# EasyEDA Pro project OT 1 ProPrj_PCB_PCB_Drum_2026-03-27_2026-04-04.epro

# Board PCB_PCB_Drum_2026-03-27
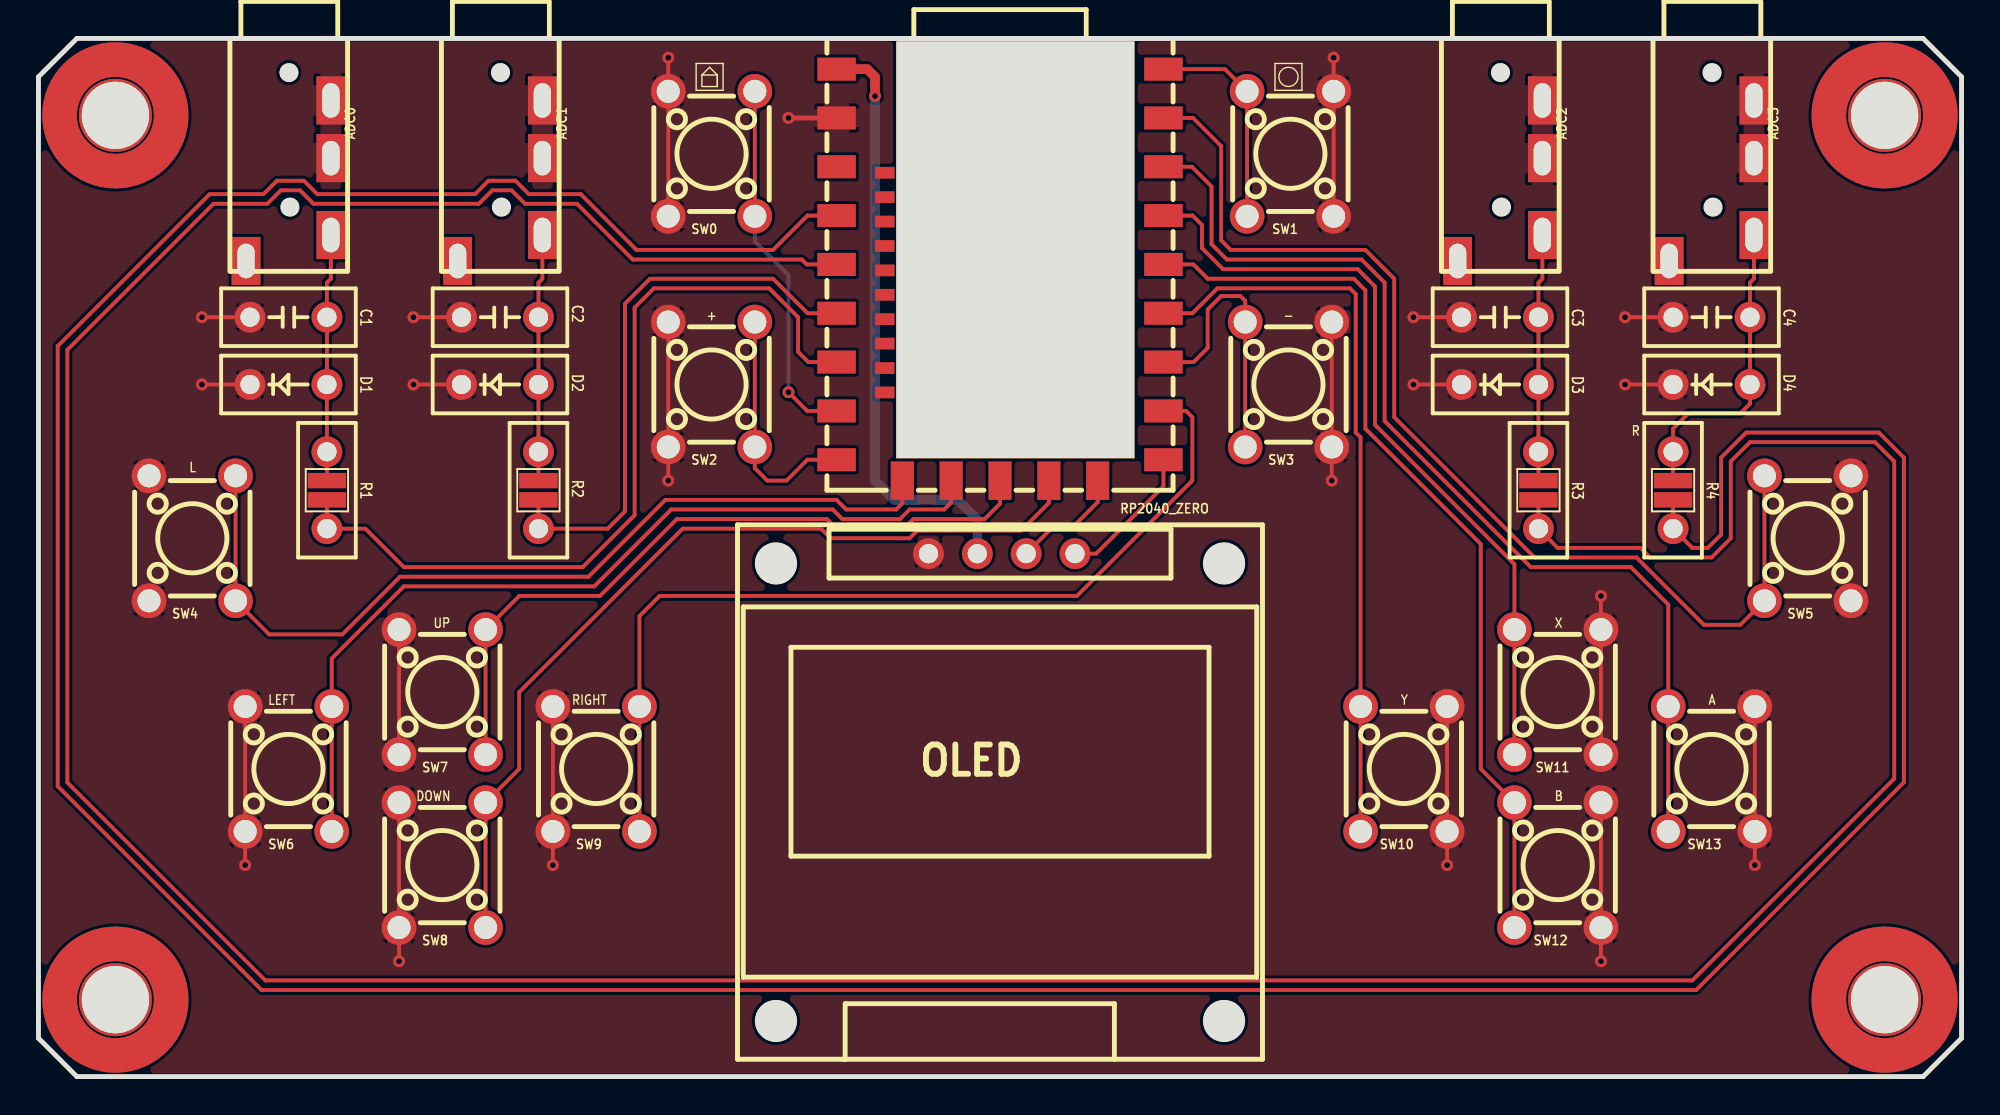
[diagram p0: board, top side]
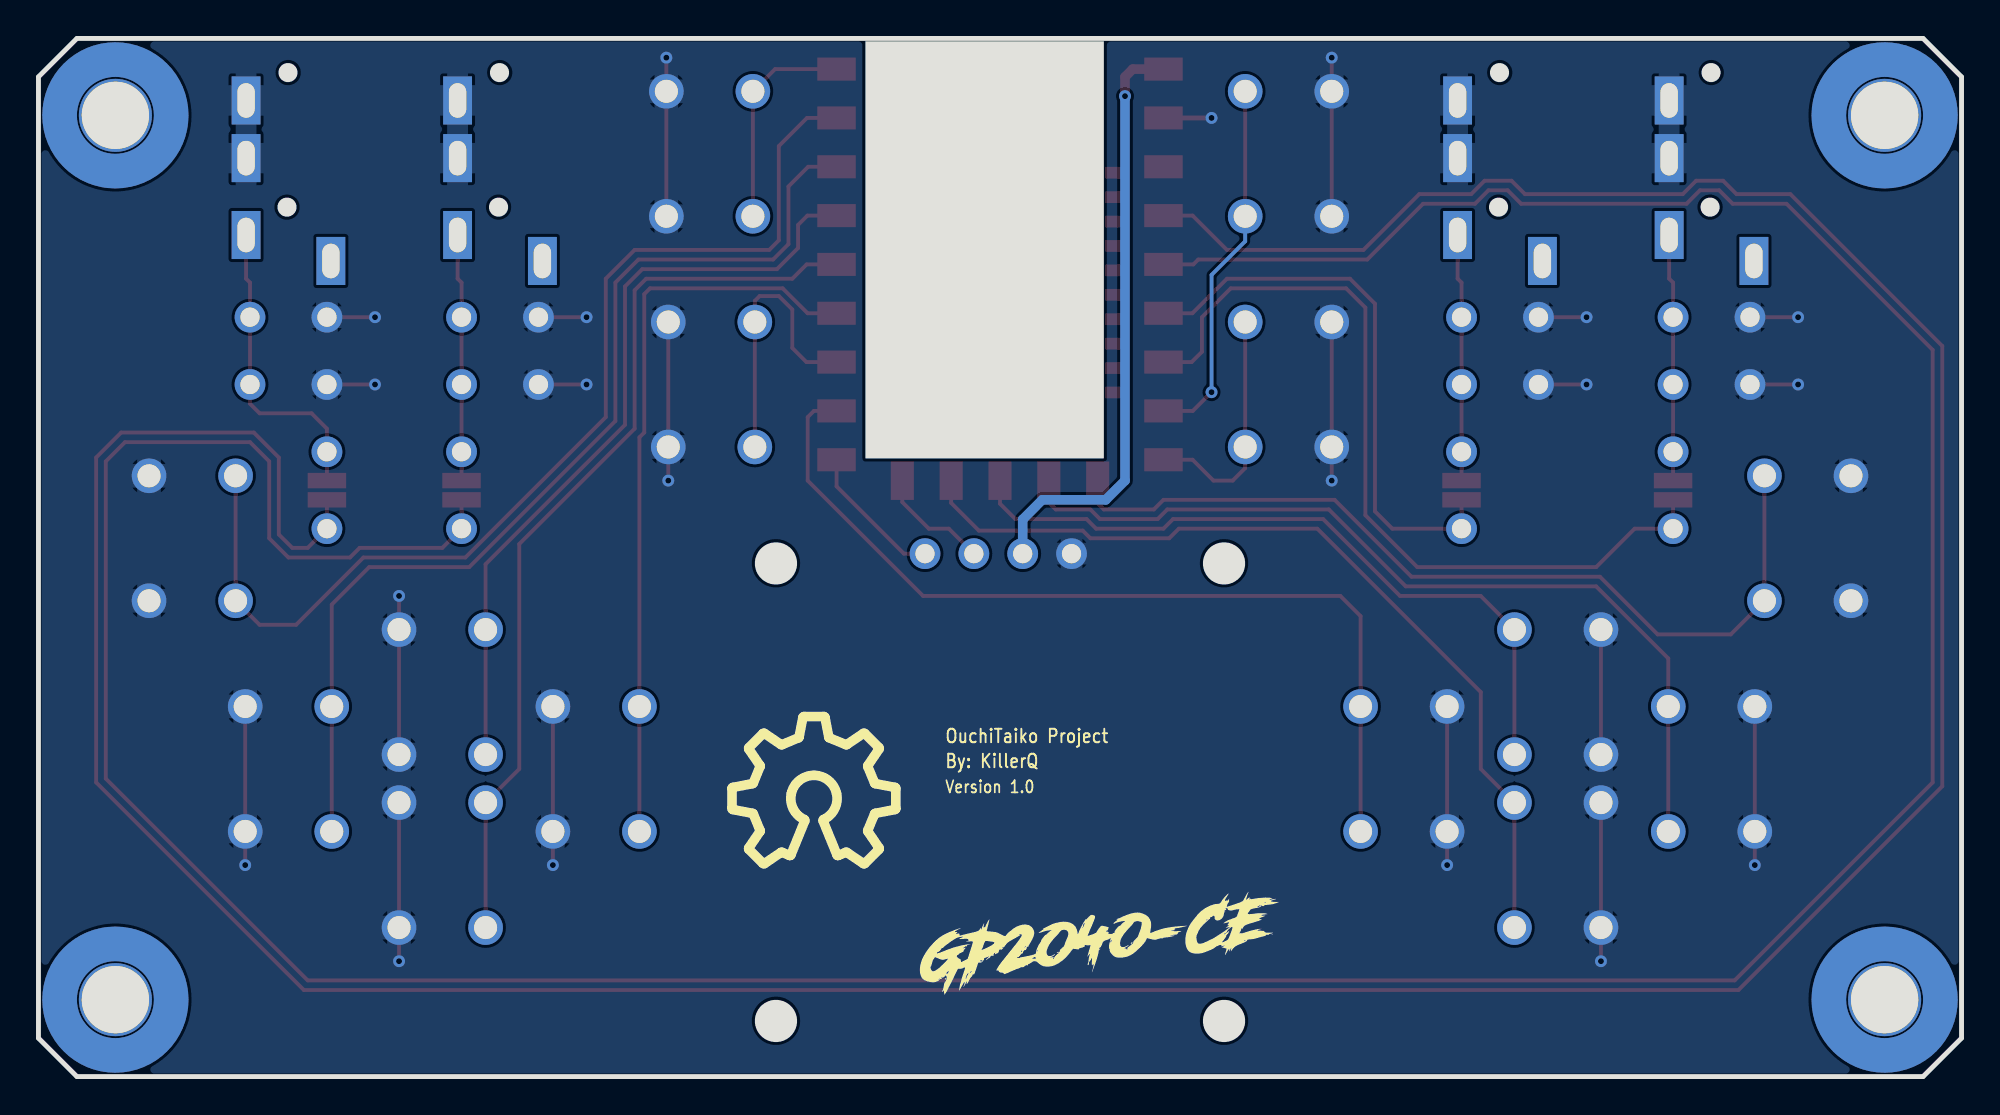
[diagram p1: board, bottom side, seen from below]

Outline 100 x 54 mm; copper layers: Top Layer, Bottom Layer. Coordinates in mm from the lower left corner of the outline.
Outline path: 0,52 2,54 98,54 100,52 100,2 98,0 2,0 0,2 0,52

## Design rules (mm)
via Default (default): diameter min 0.61, default 0.61, max 100.025; hole min 0.305, default 0.305, max 59.995
pour e13 uses gge27619
pour e367 uses gge27619(1)

## Placement (name value [footprint] x y rotation side)
ADC0  -  [AUDIO-TH_PJ-320A]  13 46.6 270 top
ADC1  -  [AUDIO-TH_PJ-320A]  24 46.6 270 top
ADC2  -  [AUDIO-TH_PJ-320A]  76 46.6 270 top
ADC3  -  [AUDIO-TH_PJ-320A]  87 46.6 270 top
NOREF  -  [Pad_e677]  11 36 180 top
NOREF#2  -  [Pad_e391]  85 30 0 top
NOREF#3  -  [Pad_e700]  26 39.5 180 top
NOREF#4  -  [Pad_e672]  96 50 0 top
NOREF#5  -  [Pad_e720]  78 36 180 top
NOREF#6  -  [Pad_e674]  4 4 0 top
NOREF#7  -  [Pad_e394]  78 30 0 top
NOREF#8  -  [Pad_e717]  78 39.5 180 top
NOREF#9  -  [Pad_e389]  26 30 0 top
NOREF#10  -  [Pad_e392]  85 31 0 top
NOREF#11  -  [Pad_e698]  22 36 180 top
NOREF#12  -  [Pad_e673]  96 4 0 top
NOREF#13  -  [Pad_e387]  15 30 0 top
NOREF#14  -  [Pad_e714]  78 32.5 90 top
NOREF#15  -  [Pad_e704]  26 28.5 90 top
NOREF#16  -  [Pad_e678]  11 39.5 180 top
NOREF#17  -  [Pad_e390]  26 31 0 top
NOREF#18  -  [Pad_e697]  26 36 180 top
NOREF#19  -  [Pad_e679]  15 39.5 180 top
NOREF#20  -  [Pad_e707]  85 39.5 180 top
NOREF#21  -  [Pad_e393]  78 31 0 top
NOREF#22  -  [Pad_e719]  74 36 180 top
NOREF#23  -  [Pad_e713]  78 28.5 90 top
NOREF#24  -  [Pad_e695]  15 32.5 90 top
NOREF#25  -  [Pad_e676]  15 36 180 top
NOREF#26  -  [Pad_e706]  85 36 180 top
NOREF#27  -  [Pad_e699]  22 39.5 180 top
NOREF#28  -  [Pad_e718]  74 39.5 180 top
NOREF#29  -  [Pad_e711]  85 32.5 90 top
NOREF#30  -  [Pad_e703]  26 32.5 90 top
NOREF#31  -  [Pad_e712]  85 28.5 90 top
NOREF#32  -  [Pad_e388]  15 31 0 top
NOREF#33  -  [Pad_e705]  89 36 180 top
NOREF#34  -  [Pad_e671]  4 50 0 top
NOREF#35  -  [Pad_e708]  89 39.5 180 top
NOREF#36  -  [Pad_e696]  15 28.5 90 top
OLED  -  [OLED-TH_OLED0.96-I2C]  50 27.2 0 top
RP2040_ZERO  -  [COMM-SMD_RP2040-ZERO]  50 41.7 0 top
SW0  -  [SW-TH_4P-L6.0-W6.0-P4.50-LS6.5]  35 48 90 top
SW1  -  [SW-TH_4P-L6.0-W6.0-P4.50-LS6.5]  65.1 48 90 top
SW2  -  [SW-TH_4P-L6.0-W6.0-P4.50-LS6.5]  35 36 90 top
SW3  -  [SW-TH_4P-L6.0-W6.0-P4.50-LS6.5]  65 36 90 top
SW4  -  [SW-TH_4P-L6.0-W6.0-P4.50-LS6.5]  8 28 90 top
SW5  -  [SW-TH_4P-L6.0-W6.0-P4.50-LS6.5]  92 28 90 top
SW6  -  [SW-TH_4P-L6.0-W6.0-P4.50-LS6.5]  13 16 90 top
SW7  -  [SW-TH_4P-L6.0-W6.0-P4.50-LS6.5]  21 20 90 top
SW8  -  [SW-TH_4P-L6.0-W6.0-P4.50-LS6.5]  21 11 90 top
SW9  -  [SW-TH_4P-L6.0-W6.0-P4.50-LS6.5]  29 16 90 top
SW10  -  [SW-TH_4P-L6.0-W6.0-P4.50-LS6.5]  71 16 90 top
SW11  -  [SW-TH_4P-L6.0-W6.0-P4.50-LS6.5]  79 20 90 top
SW12  -  [SW-TH_4P-L6.0-W6.0-P4.50-LS6.5]  79 11 90 top
SW13  -  [SW-TH_4P-L6.0-W6.0-P4.50-LS6.5]  87 16 90 top

## Footprints (pads in the part's own frame, mm; a bottom-side part is the same pattern mirrored in y, then rotated)
AUDIO-TH_PJ-320A
  rect 2.5x1.5 hole 1.8x0.9: 1(4.175,-2.204) 2(2.825,2.205) 3(-1.175,2.205) 4(-4.175,2.205)
COMM-SMD_RP2040-ZERO
  rect 2x1.2 smd: 1(8.5,10.705) 2(8.5,8.165) 3(8.5,5.625) 4(8.5,3.085) 5(8.5,0.545) 6(8.5,-1.995) 7(8.5,-4.535) 8(8.5,-7.075) 9(8.5,-9.615) 15(-8.5,-9.615) 16(-8.5,-7.075) 17(-8.5,-4.535) 18(-8.5,-1.995) 19(-8.5,0.545) 20(-8.5,3.085) 21(-8.5,5.625) 22(-8.5,8.165) 23(-8.5,10.705)
  rect 1.2x2 smd: 10(5.08,-10.705) 11(2.54,-10.705) 12(0,-10.705) 13(-2.54,-10.705) 14(-5.08,-10.705)
  rect 1.01x0.61 smd: 24(-5.99,-6.115) 25(-5.99,-4.845) 26(-5.99,-3.575) 27(-5.99,-2.305) 28(-5.99,-1.035) 29(-5.99,0.235) 30(-5.99,1.505) 31(-5.99,2.775) 32(-5.99,4.045) 33(-5.99,5.315)
OLED-TH_OLED0.96-I2C
  round 1.6 hole 1: 3(-3.72,0) 4(-1.18,0) 5(1.36,0) 6(3.9,0)
Pad_e387
  rect 2x0.8 smd: 1(0,0)
Pad_e388
  rect 2x0.8 smd: 1(0,0)
Pad_e389
  rect 2x0.8 smd: 1(0,0)
Pad_e390
  rect 2x0.8 smd: 1(0,0)
Pad_e391
  rect 2x0.8 smd: 1(0,0)
Pad_e392
  rect 2x0.8 smd: 1(0,0)
Pad_e393
  rect 2x0.8 smd: 1(0,0)
Pad_e394
  rect 2x0.8 smd: 1(0,0)
Pad_e671
  round 3.8 hole 3.5: 1(0,0)
Pad_e672
  round 3.8 hole 3.5: 1(0,0)
Pad_e673
  round 3.8 hole 3.5: 1(0,0)
Pad_e674
  round 3.8 hole 3.5: 1(0,0)
Pad_e676
  round 1.6 hole 1: 2(0,0)
Pad_e677
  round 1.6 hole 1: 3(0,0)
Pad_e678
  round 1.6 hole 1: 3(0,0)
Pad_e679
  round 1.6 hole 1: 2(0,0)
Pad_e695
  round 1.6 hole 1: 3(0,0)
Pad_e696
  round 1.6 hole 1: 2(0,0)
Pad_e697
  round 1.6 hole 1: 2(0,0)
Pad_e698
  round 1.6 hole 1: 3(0,0)
Pad_e699
  round 1.6 hole 1: 3(0,0)
Pad_e700
  round 1.6 hole 1: 2(0,0)
Pad_e703
  round 1.6 hole 1: 3(0,0)
Pad_e704
  round 1.6 hole 1: 2(0,0)
Pad_e705
  round 1.6 hole 1: 2(0,0)
Pad_e706
  round 1.6 hole 1: 3(0,0)
Pad_e707
  round 1.6 hole 1: 3(0,0)
Pad_e708
  round 1.6 hole 1: 2(0,0)
Pad_e711
  round 1.6 hole 1: 3(0,0)
Pad_e712
  round 1.6 hole 1: 2(0,0)
Pad_e713
  round 1.6 hole 1: 2(0,0)
Pad_e714
  round 1.6 hole 1: 3(0,0)
Pad_e717
  round 1.6 hole 1: 2(0,0)
Pad_e718
  round 1.6 hole 1: 3(0,0)
Pad_e719
  round 1.6 hole 1: 3(0,0)
Pad_e720
  round 1.6 hole 1: 2(0,0)
SW-TH_4P-L6.0-W6.0-P4.50-LS6.5
  round 1.8 hole 1.2: 1(-3.25,2.25) 2(3.25,2.25) 3(-3.25,-2.25) 4(3.25,-2.25)

## Nets
+3V3: RP2040_ZERO.21
+5V: OLED.4 RP2040_ZERO.23
GND: ADC0.3 ADC0.4 ADC1.3 ADC1.4 ADC2.3 ADC2.4 ADC3.3 ADC3.4 NOREF.3 NOREF#11.3 NOREF#16.3 NOREF#20.3 NOREF#22.3 NOREF#26.3 NOREF#27.3 NOREF#28.3 OLED.3 RP2040_ZERO.22 SW0.1 SW0.2 SW1.3 SW1.4 SW2.1 SW2.2 SW3.3 SW3.4 SW4.1 SW4.2 SW5.3 SW5.4 SW6.1 SW6.2 SW7.1 SW7.2 SW8.1 SW8.2 SW9.1 SW9.2 SW10.3 SW10.4 SW11.3 SW11.4 SW12.3 SW12.4 SW13.3 SW13.4
A1: RP2040_ZERO.16 SW0.3 SW0.4
A2: RP2040_ZERO.1 SW1.1 SW1.2
ADC0: NOREF#13.1 NOREF#36.2 RP2040_ZERO.17
ADC0_1: ADC0.2 NOREF#19.2 NOREF#24.3 NOREF#25.2 NOREF#32.1
ADC0_3: ADC3.2 NOREF#10.1 NOREF#29.3 NOREF#33.2 NOREF#35.2
ADC1: NOREF#9.1 NOREF#15.2 RP2040_ZERO.18
ADC1_1: ADC1.2 NOREF#3.2 NOREF#17.1 NOREF#18.2 NOREF#30.3
ADC2: NOREF#7.1 NOREF#23.2 RP2040_ZERO.19
ADC2_1: ADC2.2 NOREF#5.2 NOREF#8.2 NOREF#14.3 NOREF#21.1
ADC3: NOREF#2.1 NOREF#31.2 RP2040_ZERO.20
DOWN: RP2040_ZERO.11 SW8.3 SW8.4
K1: RP2040_ZERO.5 SW12.1 SW12.2
K2: RP2040_ZERO.3 SW13.1 SW13.2
LEFT: RP2040_ZERO.13 SW6.3 SW6.4
P1: RP2040_ZERO.6 SW10.1 SW10.2
P2: RP2040_ZERO.4 SW11.1 SW11.2
P3: RP2040_ZERO.2 SW5.1 SW5.2
P4: RP2040_ZERO.14 SW4.3 SW4.4
RIGHT: RP2040_ZERO.8 SW9.3 SW9.4
S1: RP2040_ZERO.7 SW3.1 SW3.2
S2: RP2040_ZERO.15 SW2.3 SW2.4
SCL: OLED.5 RP2040_ZERO.10
SDA: OLED.6 RP2040_ZERO.9
UP: RP2040_ZERO.12 SW7.3 SW7.4

Pads without a net: ADC0 1; ADC1 1; ADC2 1; ADC3 1; NOREF#4 1; NOREF#6 1; NOREF#12 1; NOREF#34 1; RP2040_ZERO 24 25 26 27 28 29 30 31 32 33

## Via types
v1: diameter 0.62, hole 0.31, Top Layer to Bottom Layer, 22 vias

## Routing (per net, layer and track width the routed paths; a pad name or vN(x,y) marks a point on that pad's centre or on a via; arc(x,y) is an arc through that point)
+5V: length 31.1
  Top Layer w0.5: v1(43.5,51) 43.5,52 43.1,52.41 41.5,52.41
  Bottom Layer w0.5: OLED.4 48.82,28.98 47.8,30 44.5,30 43.5,31 v1(43.5,51)
GND: length 119.8
  Top Layer w0.2: v1(81.25,6) SW12.3 SW12.4 ; SW11.3 SW11.4 v1(81.25,25) ; SW8.2 SW8.1 v1(18.75,6) ; SW6.2 SW6.1 v1(10.75,11) ; v1(67.25,31) SW3.3 SW3.4 ; v1(32.75,53) SW0.2 SW0.1 ; v1(67.35,53) SW1.4 SW1.3 ; SW7.1 SW7.2 ; SW13.4 SW13.3 v1(89.25,11) ; NOREF#26.3 v1(82.5,36) ; NOREF#20.3 v1(82.5,39.5) ; NOREF#11.3 v1(19.5,36) ; NOREF#16.3 v1(8.5,39.5) ; v1(26.75,11) SW9.1 SW9.2 ; v1(73.25,11) SW10.3 SW10.4 ; NOREF#28.3 v1(71.5,39.5) ; NOREF#27.3 v1(19.5,39.5) ; NOREF.3 v1(8.5,36) ; v1(32.75,31) SW2.1 SW2.2 ; NOREF#22.3 v1(71.5,36)
  Top Layer w0.254: 41.5,49.86 v1(39,49.86)
A1: length 19.3
  Top Layer w0.2: SW0.3 SW0.4 ; v1(39,35.6) 39.97,34.62 RP2040_ZERO.16
  Bottom Layer w0.2: 37.25,44.75 37.25,43.45 39,41.7 v1(39,35.6)
A2: length 11.3
  Top Layer w0.2: RP2040_ZERO.1 61.69,52.41 SW1.2 SW1.1
ADC0: length 43.8
  Top Layer w0.2: 15,28.5 17,28.5 19,26.5 28.3,26.5 31,29.2 31,40 32,41 38,41 39.5,39.5 39.5,37.7 40.04,37.17 41.5,37.17 ; NOREF#13.1 NOREF#36.2
ADC0_1: length 12.9
  Top Layer w0.2: NOREF#19.2 NOREF#25.2 ; ADC0.2 15.2,41.5 15,41.3 15,39.5 ; NOREF#32.1 NOREF#24.3 15,36
ADC0_3: length 16.1
  Top Layer w0.2: 89.2,43.78 89.2,41.5 89,41.3 NOREF#35.2 NOREF#33.2 89,35 88.5,34.5 85.8,34.5 85,33.7 NOREF#29.3 NOREF#10.1
ADC1: length 29.5
  Top Layer w0.2: 41.5,39.71 40,39.71 38.2,41.5 31.8,41.5 30.5,40.2 30.5,29.4 29.6,28.5 NOREF#15.2 NOREF#9.1
ADC1_1: length 12.9
  Top Layer w0.2: NOREF#17.1 NOREF#30.3 NOREF#18.2 NOREF#3.2 26,41.3 26.2,41.5 26.2,43.78
ADC2: length 214.1
  Top Layer w0.2: NOREF#7.1 NOREF#23.2 79,27.5 83.3,27.5 83.8,27 87,27 88,28 88,32 89,33 95.5,33 96.5,32 96.5,15.5 86,5 11.8,5 1.5,15.3 1.5,37.8 9.1,45.4 11.9,45.4 12.6,46.1 13.6,46.1 14.3,45.4 22.9,45.4 23.6,46.1 24.6,46.1 25.3,45.4 28,45.4 30.9,42.5 39.69,42.5 39.95,42.25 41.5,42.25
ADC2_1: length 12.9
  Top Layer w0.2: NOREF#21.1 NOREF#14.3 78,36 ; NOREF#8.2 NOREF#5.2 ; ADC2.2 78.2,41.5 78,41.3 78,39.5
ADC3: length 210.8
  Top Layer w0.2: 41.5,44.79 39.98,44.79 38.2,43 31.1,43 28.2,45.9 25.5,45.9 24.8,46.6 23.4,46.6 22.7,45.9 14.5,45.9 13.8,46.6 12.4,46.6 11.7,45.9 8.9,45.9 1,38 1,15.1 11.6,4.5 86.2,4.5 97,15.3 97,32.2 95.7,33.5 88.8,33.5 87.5,32.2 87.5,28.2 86.8,27.5 86,27.5 NOREF#31.2 NOREF#2.1
DOWN: length 46.2
  Top Layer w0.2: SW8.4 SW8.3 ; RP2040_ZERO.11 52.54,29.84 51.1,28.4 45.7,28.4 45.3,28 41.2,28 40.7,28.5 33.5,28.5 25,20 25,16 23.25,14.25
K1: length 47.4
  Top Layer w0.2: 76.75,14.25 75,16 75,27.7 69,33.7 69,40.9 68.4,41.5 60.8,41.5 60.06,42.25 58.5,42.25 ; SW12.2 SW12.1
K2: length 53.5
  Top Layer w0.2: 58.5,47.33 59.97,47.33 61,46.3 61,43.3 61.8,42.5 68.8,42.5 70,41.3 70,34.1 77.6,26.5 82.8,26.5 84.75,24.55 SW13.2 SW13.1
LEFT: length 46.1
  Top Layer w0.2: RP2040_ZERO.13 47.46,29.86 47.1,29.5 45.3,29.5 44.8,29 41.8,29 41.3,29.5 32.9,29.5 28.9,25.5 19,25.5 15.25,21.75 SW6.4 SW6.3
P1: length 38.7
  Top Layer w0.2: 58.5,39.71 60,39.71 61.3,41 68.2,41 68.5,40.7 68.5,33.5 68.75,33.25 SW10.2 SW10.1
P2: length 40.6
  Top Layer w0.2: 76.75,23.25 76.75,26.65 69.5,33.9 69.5,41.1 68.6,42 61.6,42 60.5,43.1 60.5,44.3 60.01,44.79 58.5,44.79 ; SW11.2 SW11.1
P3: length 56.3
  Top Layer w0.2: 89.75,24.75 88.5,23.5 86.6,23.5 83.1,27 77.8,27 70.5,34.3 70.5,41.5 69,43 62,43 61.5,43.5 61.5,48.4 60.04,49.87 58.5,49.87 ; SW5.1 SW5.2
P4: length 46.3
  Top Layer w0.2: 10.25,24.75 12,23 15.8,23 18.8,26 28.6,26 32.6,30 41.5,30 42,29.5 44.6,29.5 44.92,29.82 RP2040_ZERO.14 ; SW4.3 SW4.4
RIGHT: length 47.8
  Top Layer w0.2: 58.5,34.63 59.68,34.63 60,34.3 60,31 54,25 32.3,25 31.25,23.95 SW9.4 SW9.3
S1: length 14.5
  Top Layer w0.2: SW3.1 SW3.2 62.75,40.35 62.5,40.6 61.5,40.6 60.8,39.9 60.8,37.9 60.07,37.17 58.5,37.17
S2: length 12.6
  Top Layer w0.2: 41.5,32.09 39.98,32.09 38.9,31 37.9,31 37.25,31.65 37.25,32.75 ; SW2.4 SW2.3
SCL: length 5.9
  Top Layer w0.2: RP2040_ZERO.10 55.08,29.88 53.7,28.5 52.66,28.5 OLED.5
SDA: length 7.4
  Top Layer w0.2: 58.5,32.09 58.5,30.7 55,27.2 OLED.6
UP: length 37.6
  Top Layer w0.2: SW7.3 SW7.4 ; RP2040_ZERO.12 50,29.8 49.2,29 45.5,29 45,28.5 41.5,28.5 41,29 33.2,29 29.2,25 25,25 23.25,23.25

## Copper pours and planes (outline as drawn; the poured copper is in the pictures)
GND on Top Layer: -1.1,55.1 100.9,55.1 100.9,-0.9 -1.1,-0.9
GND on Bottom Layer: -0.9,54.9 101.1,54.9 101.1,-1.1 -0.9,-1.1

## Text on the board
Bottom Silkscreen Layer: Version 1.0 | OuchiTaiko Project | By: KillerQ
Top Silkscreen Layer: L | LEFT | DOWN | UP | RIGHT | + | - | Y | X | B | R | A | C1 | D1 | R1 | C2 | D2 | R2 | C3 | D3 | R3 | R4 | C4 | D4
